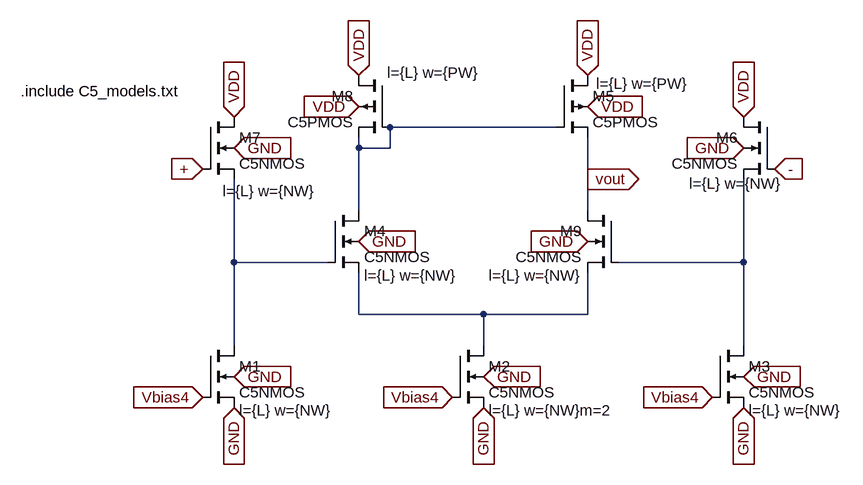
[diagram p0: schematic nmosGainEnhancement.asc]
nmosGainEnhancement.asc, the LTspice schematic file:
Version 4
SHEET 1 1108 680
WIRE 528 -128 272 -128
WIRE 224 -96 224 -112
WIRE 272 -96 272 -128
WIRE 272 -96 224 -96
WIRE 576 -48 576 -112
WIRE 224 0 224 -96
WIRE 576 0 576 -48
WIRE 32 80 32 -48
WIRE 176 80 32 80
WIRE 816 80 816 -48
WIRE 816 80 624 80
WIRE 224 160 224 96
WIRE 416 160 224 160
WIRE 576 160 576 96
WIRE 576 160 416 160
WIRE 32 208 32 80
WIRE 416 208 416 160
WIRE 816 208 816 80
FLAG 32 304 GND
IOPIN 32 304 In
FLAG 32 256 GND
IOPIN 32 256 In
FLAG 416 304 GND
IOPIN 416 304 In
FLAG 416 256 GND
IOPIN 416 256 In
FLAG 816 304 GND
IOPIN 816 304 In
FLAG 816 256 GND
IOPIN 816 256 In
FLAG 368 288 Vbias4
IOPIN 368 288 In
FLAG -16 288 Vbias4
IOPIN -16 288 In
FLAG 768 288 Vbias4
IOPIN 768 288 In
FLAG 224 48 GND
IOPIN 224 48 In
FLAG 576 48 GND
IOPIN 576 48 In
FLAG 224 -208 VDD
IOPIN 224 -208 In
FLAG 224 -160 VDD
IOPIN 224 -160 In
FLAG 576 -208 VDD
IOPIN 576 -208 In
FLAG 576 -160 VDD
IOPIN 576 -160 In
FLAG 816 -144 VDD
IOPIN 816 -144 In
FLAG 32 -144 VDD
IOPIN 32 -144 In
FLAG 32 -96 GND
IOPIN 32 -96 In
FLAG 816 -96 GND
IOPIN 816 -96 In
FLAG 864 -64 -
IOPIN 864 -64 In
FLAG -16 -64 +
IOPIN -16 -64 In
FLAG 576 -48 vout
IOPIN 576 -48 Out
SYMBOL nmos4 -16 208 R0
WINDOW 123 56 100 Left 2
SYMATTR Value2 l={L} w={NW}
SYMATTR InstName M1
SYMATTR Value C5NMOS
SYMBOL nmos4 368 208 R0
WINDOW 123 56 100 Left 2
SYMATTR Value2 l={L} w={NW}m=2
SYMATTR InstName M2
SYMATTR Value C5NMOS
SYMBOL nmos4 768 208 R0
WINDOW 123 56 100 Left 2
SYMATTR Value2 l={L} w={NW}
SYMATTR InstName M3
SYMATTR Value C5NMOS
SYMBOL nmos4 176 0 R0
WINDOW 123 56 100 Left 2
SYMATTR Value2 l={L} w={NW}
SYMATTR InstName M4
SYMATTR Value C5NMOS
SYMBOL nmos4 864 -144 M0
WINDOW 123 -12 103 Left 2
SYMATTR Value2 l={L} w={NW}
SYMATTR InstName M6
SYMATTR Value C5NMOS
SYMBOL nmos4 -16 -144 R0
WINDOW 123 31 114 Left 2
SYMATTR Value2 l={L} w={NW}
SYMATTR InstName M7
SYMATTR Value C5NMOS
SYMBOL pmos4 272 -208 M0
WINDOW 123 -138 -4 Left 2
SYMATTR Value2 l={L} w={PW}
SYMATTR InstName M8
SYMATTR Value C5PMOS
SYMBOL pmos4 528 -208 R0
WINDOW 123 61 13 Left 2
SYMATTR Value2 l={L} w={PW}
SYMATTR InstName M5
SYMATTR Value C5PMOS
SYMBOL nmos4 624 0 M0
WINDOW 123 56 100 Left 2
SYMATTR Value2 l={L} w={NW}
SYMATTR InstName M9
SYMATTR Value C5NMOS
TEXT -296 -184 Left 2 !.include C5_models.txt

The netlist it stands for:
* nmosGainEnhancement.asc
M1 N002 Vbias4 GND GND C5NMOS l={L} w={NW}
M2 N004 Vbias4 GND GND C5NMOS l={L} w={NW}m=2
M3 N003 Vbias4 GND GND C5NMOS l={L} w={NW}
M4 N001 N002 N004 GND C5NMOS l={L} w={NW}
M6 VDD - N003 GND C5NMOS l={L} w={NW}
M7 VDD + N002 GND C5NMOS l={L} w={NW}
M8 VDD N001 N001 VDD C5PMOS l={L} w={PW}
M5 VDD N001 vout VDD C5PMOS l={L} w={PW}
M9 vout N003 N004 GND C5NMOS l={L} w={NW}
.model NMOS NMOS
.model PMOS PMOS
.lib standard.mos
.include C5_models.txt
.backanno
.end